# EAGLE design OpenSprinkler_v142 (EAGLE 6.4)
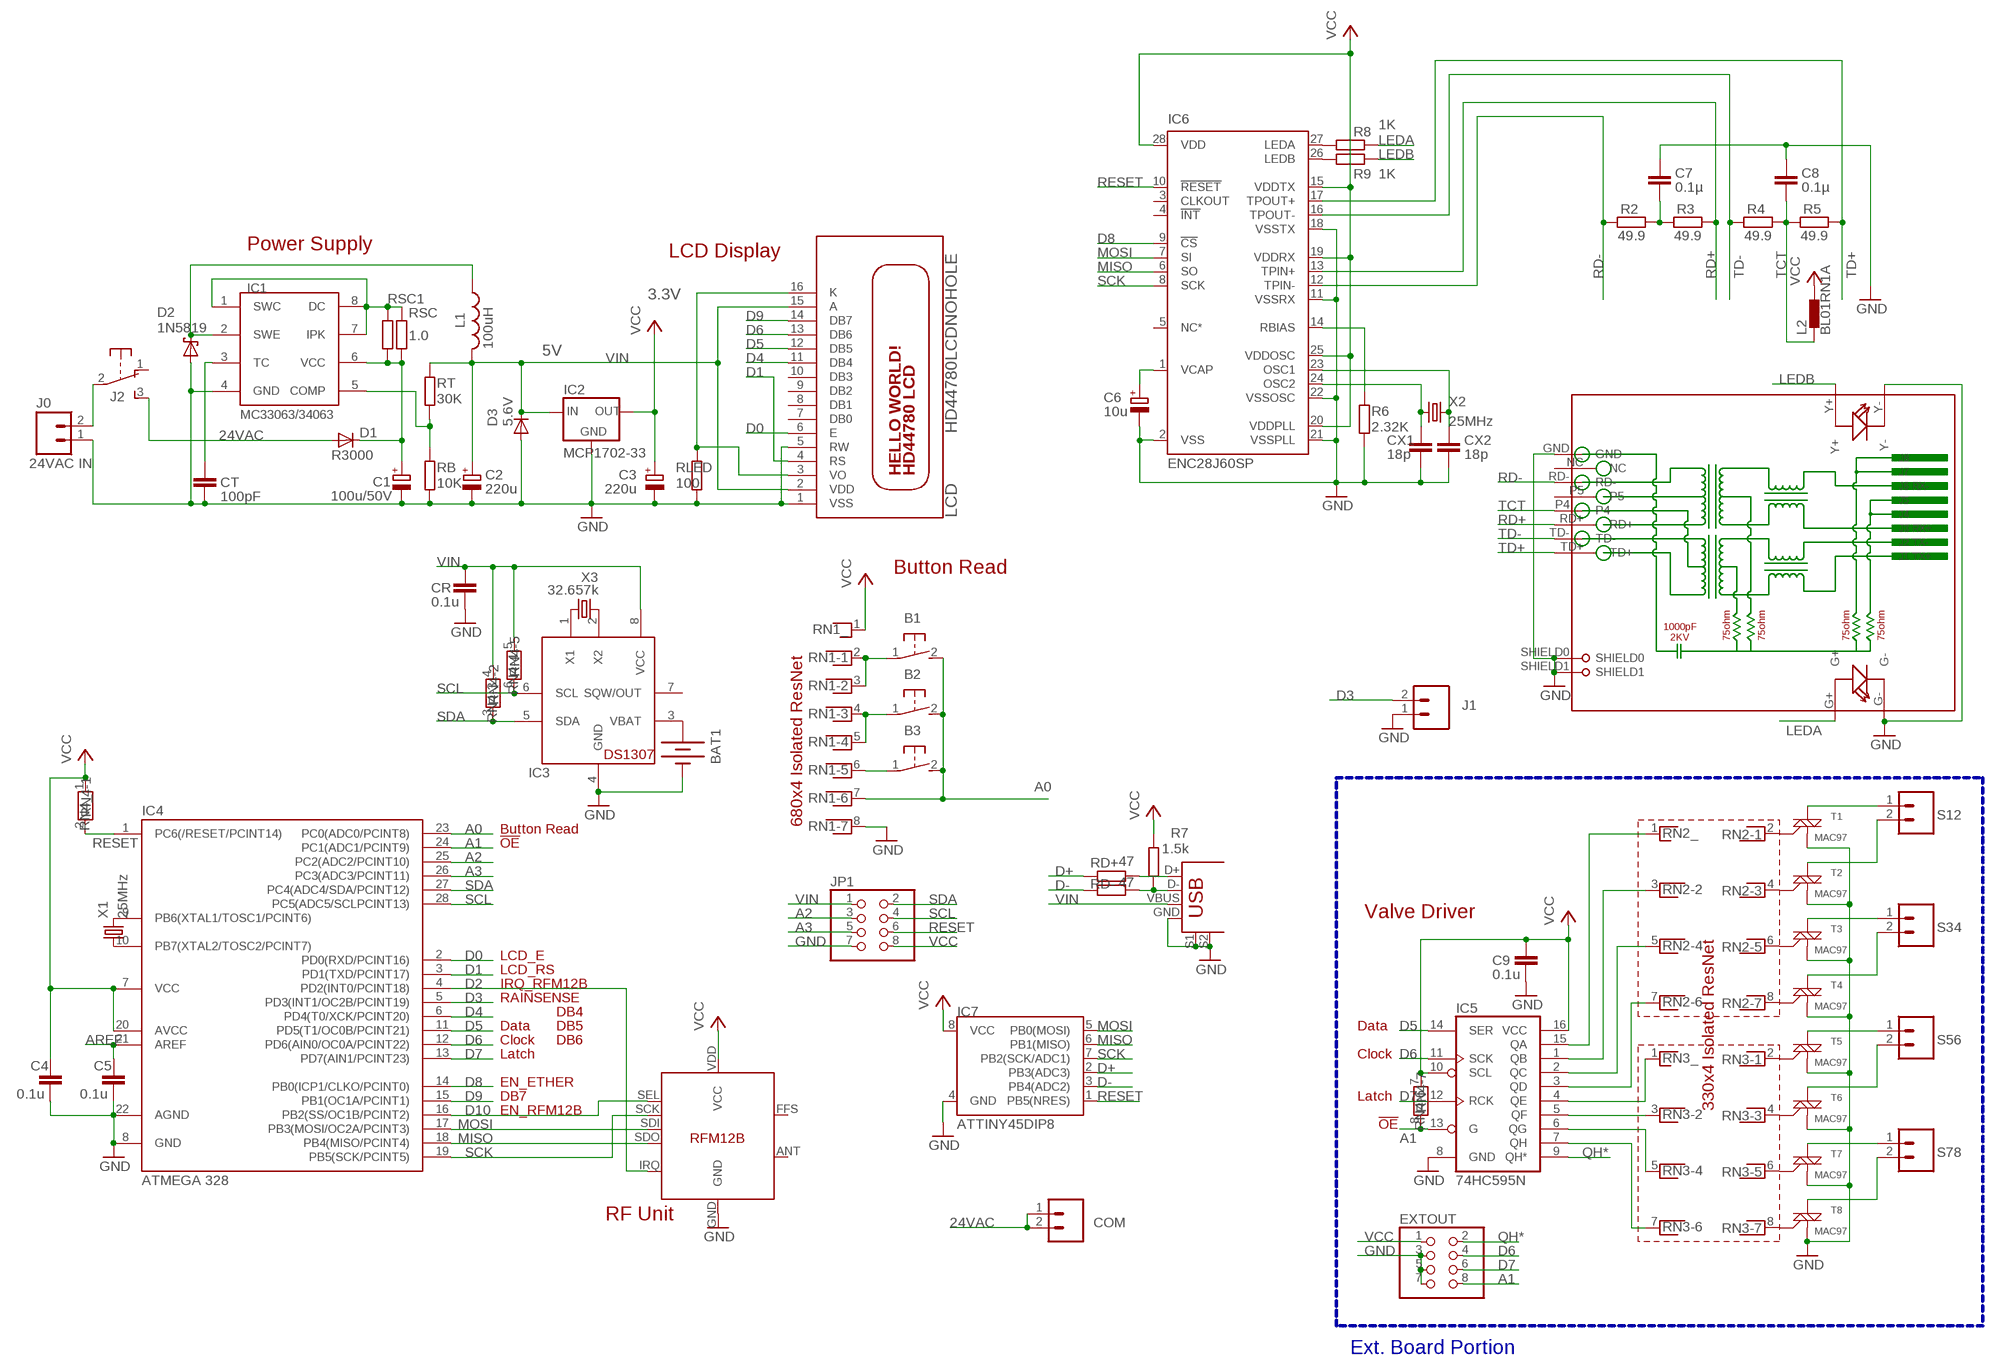
[diagram p0: schematic, sheet 1]

## Parts
B1  31-XX  [B3F-31XX]
B2  31-XX  [B3F-31XX]
B3  31-XX  [B3F-31XX]
BAT1  BATTERY12PTH  [BATTCON_12MM_PTH]
C1  100u/50V  CPOL-EUE3.5-8  [E3,5-8]
C2  220u  CPOL-EUE2-5  [E2-5]
C3  220u  CPOL-EUE2-5  [E2-5]
C4  0.1u  C-EU025-024X044  [C025-024X044]
C5  0.1u  C-EU025-024X044  [C025-024X044]
C6  10u  CPOL-EUE1.8-4  [E1,8-4]
C7  0.1µ  C-EU025-024X044  [C025-024X044]
C8  0.1µ  C-EU025-024X044  [C025-024X044]
C9  0.1u  C-EU025-024X044  [C025-024X044]
COM  M025MM  [SCREWTERMINAL-5MM-2]
CR  0.1u  C-EU025-024X044  [C025-024X044]
CT  100pF  C-EU025-024X044  [C025-024X044]
CX1  18p  C-EU025-024X044  [C025-024X044]
CX2  18p  C-EU025-024X044  [C025-024X044]
D1  R3000  DIODE-DO41-7.6  [DO41-7.6]
D2  1N5819  1N5817-B  [DO41-7.6]
D3  5.6V  1N4148DO35-7  [DO35-7]
EXTOUT  PINHD-2X4  [2X04]
IC1  MC33063/MC34063P  [DIL08]
IC2  MCP1702-33  MCP1700INLINE  [TO92-INLINE]
IC3  DS1307  [DIL08]
IC4  ATMEGA 328  ATMEGA48/88/168-PU  [DIL28-3]
IC5  74HC595N  74LS595N  [DIL16]
IC6  ENC28J60SP  [DIL28-3]
IC7  ATTINY45DIP8  [DIP08]
IC8  RFM12B  [RFM12B]
J0  24VAC IN  M025MM  [SCREWTERMINAL-5MM-2]
J1  M025MM  [SCREWTERMINAL-5MM-2]
J2  EG1206  [EG1206]
JP1  PINHD-2X4  [2X04]
L1  100uH  L-US6000-XXX-RC  [6000-XXXX-RC]
L2  BL01RN1A  [BL01RN1A]
LCD  HD44780LCDNOHOLE  [LCD1602A]
R2  49.9  R-EU_0204/7  [0204/7]
R3  49.9  R-EU_0204/7  [0204/7]
R4  49.9  R-EU_0204/7  [0204/7]
R5  49.9  R-EU_0204/7  [0204/7]
R6  2.32K  R-EU_0204/7  [0204/7]
R7  1.5k  R-EU_0204/7  [0204/7]
R8  1K  R-EU_0204/7  [0204/7]
R9  1K  R-EU_0204/7  [0204/7]
RB  10K  R-EU_0204/7  [0204/7]
RD+  47  R-EU_0204/7  [0204/7]
RD-  47  R-EU_0204/7  [0204/7]
RJ1  HR911105A  [HR911105A]
RLED  100  R-EU_0204/7  [0204/7]
RN1  RNX7  [RN-8]
RN2  RNX7  [RN-8]
RN3  RNX7  [RN-8]
RN4  RNX7  [RN-8]
RSC  1.0  R-EU_0204/7  [0204/7]
RSC1  1.0  R-EU_0204/7  [0204/7]
RT  30K  R-EU_0204/7  [0204/7]
S12  M025MM  [SCREWTERMINAL-5MM-2]
S34  M025MM  [SCREWTERMINAL-5MM-2]
S56  M025MM  [SCREWTERMINAL-5MM-2]
S78  M025MM  [SCREWTERMINAL-5MM-2]
T1  MAC97  LX807DE  [TO-92]
T2  MAC97  LX807DE  [TO-92]
T3  MAC97  LX807DE  [TO-92]
T4  MAC97  LX807DE  [TO-92]
T5  MAC97  LX807DE  [TO-92]
T6  MAC97  LX807DE  [TO-92]
T7  MAC97  LX807DE  [TO-92]
T8  MAC97  LX807DE  [TO-92]
USB  USB+SHIELD  [USB-B-PTH]
X1  25MHz  CRYSTALHC49US  [HC49US]
X2  25MHz  CRYSTALHC49US  [HC49US]
X3  32.657k  CRYSTALTC26H  [TC26H]

## Nets
24VAC [power]: COM.1 COM.2 D1.A J2.3(S)
A0: B1.2(S) B2.2(S) B3.2(S) IC4.23(PC0(ADC0/PCINT8)) RN1.7
A1: EXTOUT.8 IC4.24(PC1(ADC1/PCINT9)) IC5.13(G) RN4.8
A2: IC4.25(PC2(ADC2/PCINT10)) JP1.3
A3: IC4.26(PC3(ADC3/PCINT11)) JP1.5
AREF: C5.1 IC4.21(AREF)
D0: IC4.2(PD0(RXD/PCINT16)) LCD.6(E)
D1: IC4.3(PD1(TXD/PCINT17)) LCD.4(RS)
D2: IC4.4(PD2(INT0/PCINT18)) IC8.IRQ
D3: IC4.5(PD3(INT1/OC2B/PCINT19)) J1.2
D4: IC4.6(PD4(T0/XCK/PCINT20)) LCD.11(DB4)
D5: IC4.11(PD5(T1/OC0B/PCINT21)) IC5.14(SER) LCD.12(DB5)
D6: EXTOUT.4 IC4.12(PD6(AIN0/OC0A/PCINT22)) IC5.11(SCK) LCD.13(DB6)
D7: EXTOUT.6 IC4.13(PD7(AIN1/PCINT23)) IC5.12(RCK)
D8: IC4.14(PB0(ICP1/CLKO/PCINT0)) IC6.9(!CS)
D9: IC4.15(PB1(OC1A/PCINT1)) LCD.14(DB7)
D10: IC4.16(PB2(SS/OC1B/PCINT2)) IC8.SEL
D+: IC7.2(PB3(ADC3)) RD+.1
D-: IC7.3(PB4(ADC2)) RD-.1
GND [power]: BAT1.GND(-) C1.- C2.- C3.- C4.2 C5.2 C6.- C7.1 C8.1 C9.2 CR.2 CT.2 CX1.2 CX2.2 D2.A D3.A EXTOUT.3 EXTOUT.5 EXTOUT.7 IC1.4(GND) IC2.1(GND) IC3.4(GND) IC4.8(GND) IC4.22(AGND) IC5.8(GND) IC6.2(VSS) IC6.11(VSSRX) IC6.18(VSSTX) IC6.21(VSSPLL) IC6.22(VSSOSC) IC7.4(GND) IC8.GND J0.1 J1.1 JP1.7 LCD.1(VSS) LCD.5(RW) R6.2 RB.2 RJ1.G- RJ1.GND RJ1.SHIELD0 RJ1.SHIELD1 RJ1.Y- RLED.2 RN1.8 T1.1(M1) T2.1(M1) T3.1(M1) T4.1(M1) T5.1(M1) T6.1(M1) T7.1(M1) T8.1(M1) USB.GND USB.S1 USB.S2
LEDA: R8.2 RJ1.G+
LEDB: R9.2 RJ1.Y+
MISO: IC4.18(PB4(MISO/PCINT4)) IC6.6(SO) IC7.6(PB1(MISO)) IC8.SDO
MOSI: IC4.17(PB3(MOSI/OC2A/PCINT3)) IC6.7(SI) IC7.5(PB0(MOSI)) IC8.SDI
N$2: IC4.9(PB6(XTAL1/TOSC1/PCINT6)) X1.2
N$3: RN2.2 T1.2(G)
N$4: IC5.5(QF) RN3.3
N$5: IC5.6(QG) RN3.5
N$6 [power]: J0.2 J2.2(P)
N$7: IC5.7(QH) RN3.7
N$8: IC4.10(PB7(XTAL2/TOSC2/PCINT7)) X1.1
N$9 [power]: C1.+ D1.C IC1.6(VCC) RSC1.2 RSC.2
N$10: IC5.4(QE) RN3.1
N$11: IC5.3(QD) RN2.7
N$12: IC5.2(QC) RN2.5
N$13: IC5.1(QB) RN2.3
N$14: IC5.15(QA) RN2.1
N$15: RN2.4 T2.2(G)
N$16 [power]: S12.1 T1.3(M2)
N$17 [power]: S12.2 T2.3(M2)
N$18 [power]: S34.1 T3.3(M2)
N$19: RN2.6 T3.2(G)
N$20 [power]: S34.2 T4.3(M2)
N$21: RN2.8 T4.2(G)
N$22 [power]: S56.1 T5.3(M2)
N$23 [power]: S56.2 T6.3(M2)
N$24 [power]: S78.1 T7.3(M2)
N$25 [power]: S78.2 T8.3(M2)
N$26: RN3.2 T5.2(G)
N$27: RN3.4 T6.2(G)
N$28: RN3.6 T7.2(G)
N$29: RN3.8 T8.2(G)
N$32: B1.1(P) RN1.2 RN1.3
N$33: B3.1(P) RN1.6
N$35: B2.1(P) RN1.4 RN1.5
N$36: BAT1.VCC@1(+) IC3.3(VBAT)
N$37: IC6.27(LEDA) R8.1
N$38: RD+.2 USB.D+
N$39: IC6.26(LEDB) R9.1
N$40 [power]: IC1.1(SWC) IC1.7(IPK) IC1.8(DC) RSC1.1 RSC.1
N$45: R7.1 RD-.2 USB.D-
N$46 [power]: D2.C IC1.2(SWE) L1.1
N$47: IC3.2(X2) X3.2
N$48: LCD.3(VO) LCD.16(K) RLED.1
N$49: CT.1 IC1.3(TC)
N$50: C6.+ IC6.1(VCAP)
N$51: IC6.14(RBIAS) R6.1
N$52: CX1.1 IC6.24(OSC2) X2.1
N$53: CX2.1 IC6.23(OSC1) X2.2
N$54: C7.2 R2.2 R3.1
N$55: IC1.5(COMP) RB.1 RT.2
N$57: IC3.1(X1) X3.1
QH*: EXTOUT.2 IC5.9(QH*)
RD+: IC6.13(TPIN+) R3.2 RJ1.RD+
RD-: IC6.12(TPIN-) R2.1 RJ1.RD-
RESET: IC4.1(PC6(/RESET/PCINT14)) IC6.10(!RESET) IC7.1(PB5(NRES)) JP1.6 RN4.2
SCK: IC4.19(PB5(SCK/PCINT5)) IC6.8(SCK) IC7.7(PB2(SCK/ADC1)) IC8.SCK
SCL: IC3.6(SCL) IC4.28(PC5(ADC5/SCLPCINT13)) JP1.4 RN4.6
SDA: IC3.5(SDA) IC4.27(PC4(ADC4/SDA/PCINT12)) JP1.2 RN4.3
TCT: C8.2 L2.1 R4.2 R5.1 RJ1.P4
TD+: IC6.17(TPOUT+) R5.2 RJ1.TD+
TD-: IC6.16(TPOUT-) R4.1 RJ1.TD-
VCC: C3.+ C4.1 C9.1 EXTOUT.1 IC2.3(OUT) IC4.7(VCC) IC4.20(AVCC) IC5.10(SCL) IC5.16(VCC) IC6.15(VDDTX) IC6.19(VDDRX) IC6.20(VDDPLL) IC6.25(VDDOSC) IC6.28(VDD) IC7.8(VCC) IC8.VDD(VCC) JP1.8 L2.2 R7.2 RN1.1 RN4.1 RN4.7
VIN [power]: C2.+ CR.1 D3.C IC2.2(IN) IC3.8(VCC) JP1.1 L1.2 LCD.2(VDD) LCD.15(A) RN4.4 RN4.5 RT.1 USB.VBUS
Unconnected: IC3.7(SQW/OUT) IC6.3(CLKOUT) IC6.4(!INT) IC6.5(NC*) IC8.ANT IC8.FFS J2.1(O) LCD.7(DB0) LCD.8(DB1) LCD.9(DB2) LCD.10(DB3) RJ1.NC RJ1.P5

## Buses
B$1

## Notes on the sheet
- Power Supply
- LCD Display
- 3.3V
- 5V
- Button Read
- 680x4 Isolated ResNet
- Button Read
- !OE
- Valve Driver
- 330x4 Isolated ResNet
- LCD_E
- LCD_RS
- IRQ_RFM12B
- RAINSENSE
- DB4
- Data | DB5 | Data
- Clock | DB6
- Latch | Clock
- EN_ETHER
- DB7 | Latch
- EN_RFM12B
- !OE
- RF Unit
- Ext. Board Portion

## Library data of the parts
B1-B3 = adafruit:31-XX: OMRON SWITCH Now with beefier pads!
BAT1 = SparkFun:BATTERY: Battery Holders Various common sizes : AA, AAA, 20mm coin cell and 12mm coin cell.
C1-C3 C6 = resistor:CPOL-EU: POLARIZED CAPACITOR, European symbol
C4 C5 C9 CR CT = rcl:C-EU: CAPACITOR, European symbol
C7 C8 CX1 CX2 = resistor:C-EU: CAPACITOR, European symbol
COM J0 J1 S12 S34 S56 S78 = SparkFun:M02: Header 2 Standard 2-pin 0.1" header. Use with straight break away headers (SKU : PRT-00116), right angle break away headers (PRT-00553), swiss pins (PRT-00743), machine pins (PRT-00117), and female headers (PRT-00115). Molex polarized connector foot print use with SKU : PRT-08233 with associated crimp pins and housings.
D1 = diode:DIODE-: DIODE
D2 = diode:1N581*: 1.0A SCHOTTKY BARRIER RECTIFIER Source: http://www.diodes.com/datasheets/ds23001.pdf
D3 = diode:1N4148: DIODE high speed (Philips)
EXTOUT JP1 = pinhead:PINHD-2X4: PIN HEADER
IC1 = adafruit:MC33063/MC34063: MC33063 and MC34063 Basic DC/DC converter with internal power-NPN transistor, 100KHz, 1.5A peak switch current. 3-40 input/output.
IC2 = adafruit:MCP1700: VOLTAGE REGULATOR
IC3 = adafruit:DS1307: DS1307 Real time clock (RTC) with battery backup ability. Talk to it via i2c
IC4 = atmega8:ATMEGA48/88/168-PU
IC5 = SparkFun:74*595: 8-bit SHIFT REGISTER, output latch
IC6 = microchip:ENC28J60: Stand-Alone Ethernet Controller with SPI Interface Source: http://ww1.microchip.com/downloads/en/DeviceDoc/39662c.pdf; MF: MICROCHIP; MPN: ENC28J60/SP; OC_FARNELL: 1084619; OC_NEWARK: 96K3661
IC7 = SparkFun:ATTINY45: Atmel ATTiny45
IC8 = JeeLabs:RFM12B
J2 = adafruit:EG1206
L1 = rcl:L-US: INDUCTOR, American symbol
L2 = inductors:BL0: Noise Suppression Products/EMI Suppression Filters, Lead EMIFIL(R) Inductor Type Source: http://www.murata.com .. BL01RN1_DS.pdf
LCD = adafruit:HD44780LCD: HD44780 LCD Standard character type LCDs, available in sizes from 8x1 to 40x4!
R2-R9 RB RD+ RD- RLED RSC RSC1 RT = rcl:R-EU_: RESISTOR, European symbol
RJ1 = CONNECTER:HR911105A
RN1-RN4 = resistor-net:RNX7: RESISTOR NETWORK; OC_FARNELL: unknown; OC_NEWARK: unknown
T1-T8 = SparkFun:LX807DE: LX807DE Triac http://www.littelfuse.com/data/en/Data_Sheets/Littelfuse_Triac_LX8.pdf
USB = SparkFunNew:USB+SHIELD: USB+Shield USB connector with shield pins connectable
X1 X2 = SparkFun:CRYSTAL: Crystals Various standard crystals. Proven footprints. Spark Fun Electronics SKU : COM-00534
X3 = crystal:CRYSTAL: CRYSTAL; OC_FARNELL: unknown; OC_NEWARK: unknown

## Net classes
0 default: width 0.305 mm, clearance 0.203 mm
1 power: width 0.813 mm, clearance 0.203 mm

## Board
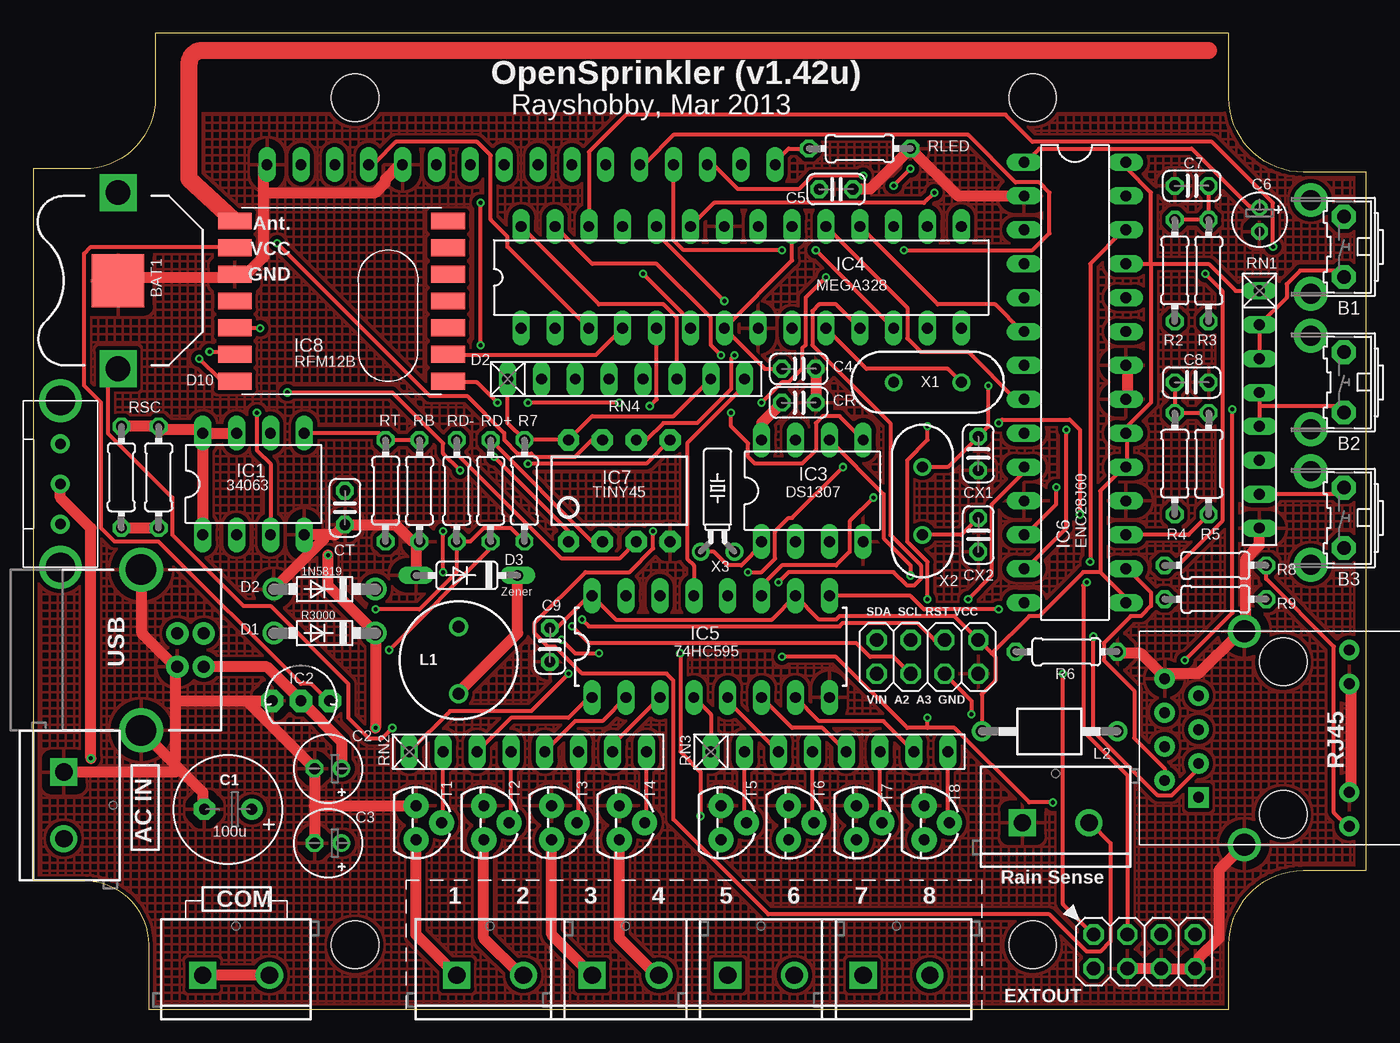
[diagram p1: board, top side]
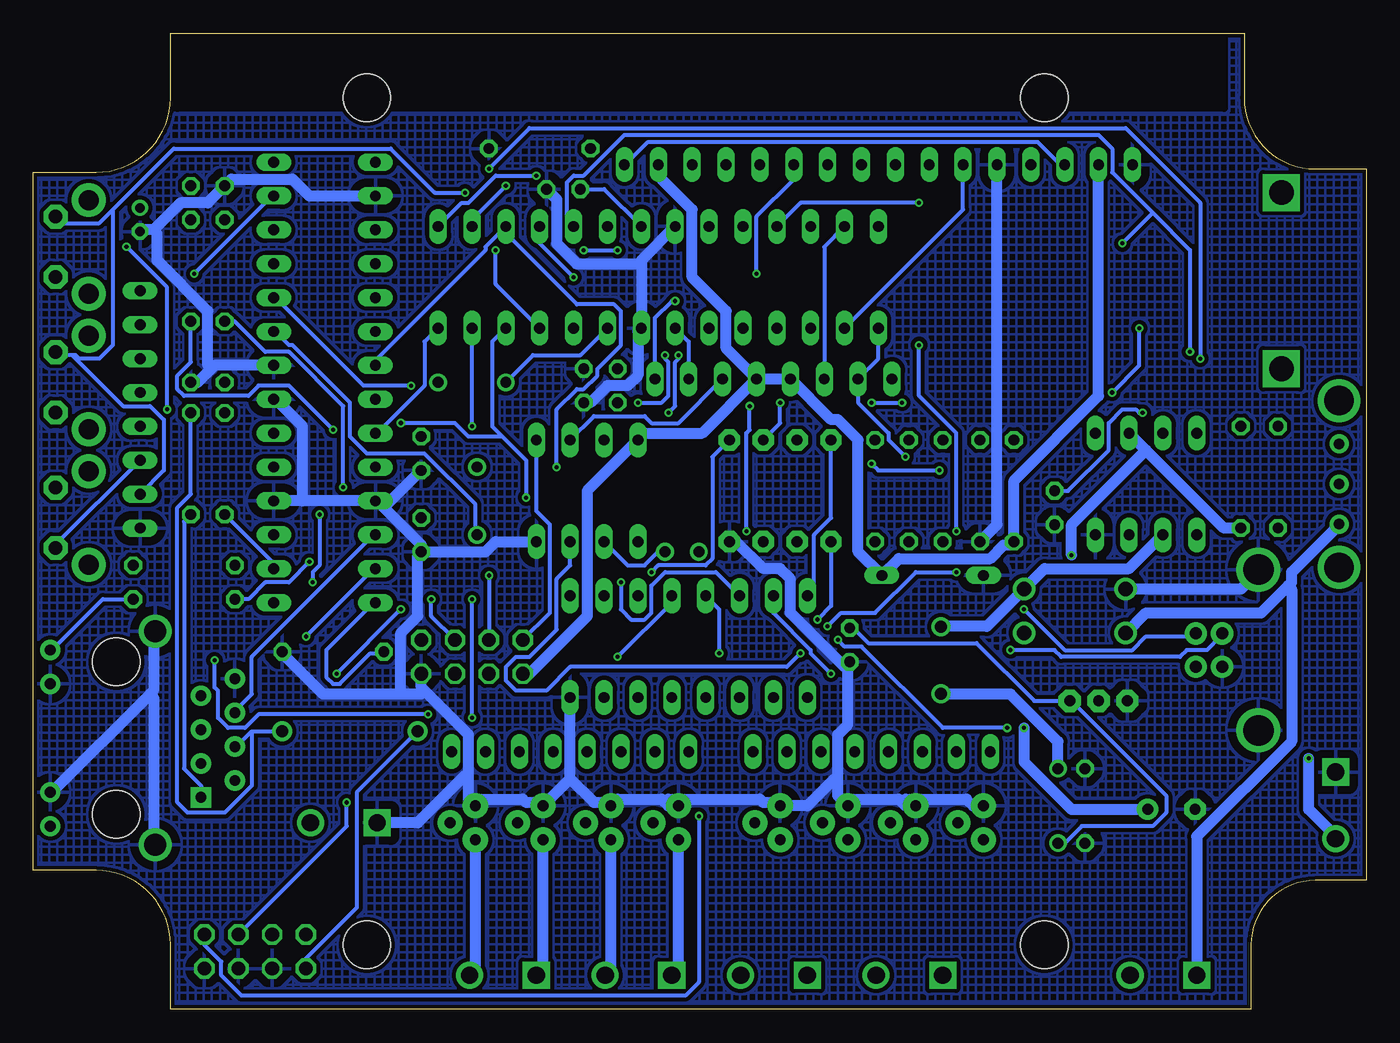
[diagram p2: board, bottom side, seen from below]

Size 99.95 x 73.15 mm. Coordinates in mm from the lower left corner, seen from the top.
Outline: 8.64,0 89.66,0 89.66,4.83 arc-90 95.25,10.41 99.95,10.41 99.95,62.74 95.25,62.74 arc-90 89.66,68.33 89.66,73.15 9.14,73.15 9.14,68.33 arc-90 3.81,62.99 0,62.99 0,9.65 3.81,9.65 arc-90 8.64,4.83 8.64,0
Copper layers (1*16): Top 0.035mm / dielectric 1.5mm / Bottom 0.035mm
Design rules "Fusion_eagle_rule_v1.1 *": minimum track width 6mil, minimum drill 12mil, track to track 6mil, track to pad 6mil, pad to pad 8mil, via to via 8mil, smd to smd 0mil, copper to edge 10mil, drill to drill 10mil, minimum pad ring 10mil, minimum via ring 6mil, stop-mask expansion 2mil, vias tented up to drill 100mil, thermal gap 25mil
Holes 3.56 mm at 24.13,4.83 74.93,4.83 24.13,68.33 74.93,68.33
tRestrict: area 10.7,67.6 to 89.2,72.6
bRestrict: area 10.7,67.6 to 89.2,72.6
vRestrict: area 21.6,2.3 to 26.7,7.4; area 72.4,2.3 to 77.5,7.4; area 64.8,33 to 68.6,43.2; area 25.9,43.7 to 29.7,44.5; area 31,43.7 to 37.6,44.5; area 17.3,13.5 to 18,14.2; area 93,59.7 to 93.7,60.2; area 62.5,29.5 to 71.6,30.2; area 62.5,22.9 to 71.6,23.6; area 42.2,38.4 to 45.5,40.4; area 56.4,38.4 to 60.2,40.6

### Footprints (pad centres in the part's own frame; a part is rotated, then mirrored left to right if it is on the bottom)
B3F-31XX = drill 1.016 pad 1.778 octagon: 1 -2.261,-1.245; 2 2.261,-1.245 | drill 1.499 pad 2.54: 3 -3.505,1.245; 4 3.505,1.245
BATTCON_12MM_PTH = smd 3.962 x 3.962: GND 0,0 | drill 1.854 square: VCC@1 -6.604,0; VCC@2 6.604,0
E3,5-8 = drill 0.813 pad 1.6: + -1.778,0 | drill 0.813 pad 1.6 octagon: - 1.778,0
E2-5 = drill 0.813 pad 1.27: + -1.016,0 | drill 0.813 pad 1.27 octagon: - 1.016,0
C025-024X044 = drill 0.813 octagon: 1 -1.27,0; 2 1.27,0
E1,8-4 = drill 0.711 pad 1.168: + -0.889,0 | drill 0.711 pad 1.168 octagon: - 0.889,0
SCREWTERMINAL-5MM-2 = drill 1.3 pad 2.032 square: 1 0,0 | drill 1.3 pad 2.032: 2 5,0
DO41-7.6 = drill 1.1 pad 1.7: A 3.81,0; C -3.81,0
DO35-7 = drill 0.813 long: A 3.81,0; C -3.81,0
2X04 = drill 1.016 octagon: 1 -3.81,-1.27; 2 -3.81,1.27; 3 -1.27,-1.27; 4 -1.27,1.27; 5 1.27,-1.27; 6 1.27,1.27; 7 3.81,-1.27; 8 3.81,1.27
DIL08 = drill 0.813 long: 1 -3.81,-3.81; 2 -1.27,-3.81; 3 1.27,-3.81; 4 3.81,-3.81; 5 3.81,3.81; 6 1.27,3.81; 7 -1.27,3.81; 8 -3.81,3.81
TO92-INLINE = drill 0.813 pad 1.676 octagon: 1 -2.159,0; 2 0,0; 3 2.159,0
DIL28-3 = drill 0.813 long: 1 -16.51,-3.81; 2 -13.97,-3.81; 3 -11.43,-3.81; 4 -8.89,-3.81; 5 -6.35,-3.81; 6 -3.81,-3.81; 7 -1.27,-3.81; 8 1.27,-3.81; 9 3.81,-3.81; 10 6.35,-3.81; 11 8.89,-3.81; 12 11.43,-3.81; 13 13.97,-3.81; 14 16.51,-3.81; 15 16.51,3.81; 16 13.97,3.81; 17 11.43,3.81; 18 8.89,3.81; 19 6.35,3.81; 20 3.81,3.81; 21 1.27,3.81; 22 -1.27,3.81; 23 -3.81,3.81; 24 -6.35,3.81; 25 -8.89,3.81; 26 -11.43,3.81; 27 -13.97,3.81; 28 -16.51,3.81
DIL16 = drill 0.813 long: 1 -8.89,-3.81; 2 -6.35,-3.81; 3 -3.81,-3.81; 4 -1.27,-3.81; 5 1.27,-3.81; 6 3.81,-3.81; 7 6.35,-3.81; 8 8.89,-3.81; 9 8.89,3.81; 10 6.35,3.81; 11 3.81,3.81; 12 1.27,3.81; 13 -1.27,3.81; 14 -3.81,3.81; 15 -6.35,3.81; 16 -8.89,3.81
DIP08 = drill 0.813 pad 1.6 octagon: 1 -3.81,-3.81; 2 -1.27,-3.81; 3 1.27,-3.81; 4 3.81,-3.81; 5 3.81,3.81; 6 1.27,3.81; 7 -1.27,3.81; 8 -3.81,3.81
RFM12B = smd 2.54 x 1.27: ANT 8,-6; FFS -8,2; GND 8,-2; IRQ -8,4; P$8 -8,0; P$9 -8,-2; P$10 -8,-4; P$12 -8,-6; P$16 8,0; SCK 8,4; SDI 8,2; SDO -8,6; SEL 8,6; VDD 8,-4
EG1206 = drill 0.8 pad 1.422: 1 -3,0; 2 0,0; 3 3,0 | drill 2.2: MT1 -6.25,0; MT2 6.25,0
6000-XXXX-RC = drill 0.9 pad 1.422: 1 -2.5,0; 2 2.5,0
BL01RN1A = drill 0.9 pad 1.5: 1 -5.08,0; 2 5.08,0
LCD1602A = drill 0.8 long: 1 8,33.46; 2 10.54,33.46; 3 13.08,33.46; 4 15.62,33.46; 5 18.16,33.46; 6 20.7,33.46; 7 23.24,33.46; 8 25.78,33.46; 9 28.32,33.46; 10 30.86,33.46; 11 33.4,33.46; 12 35.94,33.46; 13 38.48,33.46; 14 41.02,33.46; 15 43.56,33.46; 16 46.1,33.46
0204/7 = drill 0.813 octagon: 1 -3.81,0; 2 3.81,0
HR911105A = drill 0.813 pad 1.524: G+ 4.953,-6.604; G- 4.953,-4.064; GND -8.89,4.445; NC -6.35,3.175; P4 -8.89,-0.635; P5 -6.35,0.635; RD+ -6.35,-1.905; RD- -8.89,1.905; TD- -8.89,-3.175; Y+ 4.953,6.604; Y- 4.953,4.064 | drill 1.651 pad 2.159: SHIELD0 -2.921,8.001; SHIELD1 -2.921,-8.001 | drill 0.813 pad 1.524 square: TD+ -6.35,-4.445 | hole 3.556: 0,-5.715; 0,5.715
RN-8 = drill 0.813 long: 1 -8.89,0; 2 -6.35,0; 3 -3.81,0; 4 -1.27,0; 5 1.27,0; 6 3.81,0; 7 6.35,0; 8 8.89,0
TO-92 = drill 0.813 pad 1.88: 1 -1.27,0; 2 0,1.905; 3 1.27,0
USB-B-PTH = drill 0.914 pad 1.676: D+ 0,1.25; D- 1.981,1.25; GND 0,-1.25; VBUS 1.981,-1.25 | drill 2.286: S1 -2.718,-6.02; S2 -2.718,6.02
HC49US = drill 0.813: 1 -2.54,0; 2 2.54,0
TC26H = drill 0.813: 1 -1.27,0; 2 1.27,0

### Placement (x,y rotation side)
B1  97.03,57.15 90 top
B2  97.03,46.99 90 top
B3  97.03,36.83 90 top
BAT1  6.35,54.61 90 top
C1  14.61,14.99 180 top
C2  22.1,18.03 180 top
C3  22.1,12.45 180 top
C4  57.4,48.01 0 top
C5  60.2,61.47 0 top
C6  91.95,59.18 270 top
C7  86.87,61.72 0 top
C8  86.87,46.99 180 top
C9  38.73,27.3 270 top
COM  12.7,2.54 0 top
CR  57.4,45.47 0 top
CT  23.37,37.59 270 top
CX1  70.87,41.66 270 top
CX2  70.87,35.56 270 top
D1  21.84,28.19 180 top
D2  21.84,31.5 180 top
D3  32.51,32.51 180 top
EXTOUT  83.31,4.32 0 top
IC1  16.51,39.37 0 top
IC2  20.07,23.11 0 top
IC3  58.42,38.86 0 top
IC4  53.09,54.86 0 top
IC5  50.8,27.18 0 top
IC6  78.11,46.99 270 top
IC7  43.94,38.86 0 top
IC8  23.11,53.09 180 top
J0  2.29,17.78 270 top
J1  74.17,13.97 0 top
J2  2.03,39.37 270 top
JP1  67.06,26.42 0 top
L1  31.88,26.16 270 top
L2  76.2,20.83 180 top
LCD  9.53,29.84 0 top
R2  85.6,55.37 90 top
R3  88.14,55.37 270 top
R4  85.6,40.89 90 top
R5  88.14,40.89 270 top
R6  77.47,26.8 0 top
R7  36.83,38.86 90 top
R8  88.65,33.27 0 top
R9  88.65,30.73 0 top
RB  28.96,38.86 270 top
RD+  34.29,38.86 270 top
RD-  31.75,38.86 270 top
RJ1  93.73,20.32 0 top
RLED  61.98,64.52 0 top
RN1  91.95,44.96 270 top
RN2  37.08,19.3 0 top
RN3  59.69,19.3 0 top
RN4  44.45,47.24 0 top
RSC  6.6,39.88 270 top
RSC1  9.4,39.88 270 top
RT  26.42,38.86 90 top
S12  31.75,2.54 0 top
S34  41.91,2.54 0 top
S56  52.07,2.54 0 top
S78  62.23,2.54 0 top
T1  28.7,13.97 270 top
T2  33.78,13.97 270 top
T3  38.86,13.97 270 top
T4  43.94,13.97 270 top
T5  51.56,13.97 270 top
T6  56.64,13.97 270 top
T7  61.72,13.97 270 top
T8  66.8,13.97 270 top
USB  10.79,26.92 0 top
X1  67.06,46.99 180 top
X2  66.67,38.1 270 top
X3  51.31,34.29 0 top

### Tracks (layer width: path | path; a pad name or v marks a point on that pad's centre or on a via)
24VAC
  Top 0.813: COM.2 COM.1
  Bottom 0.813: 5.84,31.75 7.87,29.72 16.51,29.72 D1.A | 5.84,31.75 5.59,32 5.59,32.77 2.03,36.32 J2.3 | COM.1 12.7,12.95 5.59,20.07 5.59,31.5 5.84,31.75
A0  (via drill 0.3)
  Top 0.305: RN1.7 97.79,38.61 B3.2 | IC4.23 51.05,60.45 66.8,60.45 v67.56,61.21
  Bottom 0.305: v67.56,61.21 69.85,61.21 73.15,64.52 89.41,64.52 93.98,59.94 | 93.98,59.94 95,58.93 97.79,58.93 B1.2 | 97.03,49.02 96.77,49.02 96.52,48.77 95,48.77 93.98,49.78 93.98,59.94 | 97.03,49.02 98.04,49.02 B2.2 | RN1.7 90.17,40.39 90.17,44.2 91.19,45.21 93.22,45.21 97.03,49.02
A1  (via drill 0.3)
  Top 0.305: IC5.13 49.53,33.27 49.02,33.78 49.02,42.42 53.34,46.74 RN4.8 | IC4.24 46.74,58.17 v51.82,53.09 | v50.04,14.48 50.04,17.78 48.51,19.3 v48.51,26.67
  Bottom 0.305: v51.82,53.09 52.07,53.09 53.34,51.82 RN4.8 | EXTOUT.8 87.12,4.83 85.85,3.56 85.85,2.54 84.33,1.02 51.05,1.02 50.04,2.03 v50.04,14.48 | v48.51,26.67 48.51,29.97 IC5.13
A2  (via drill 0.3)
  Top 0.305: v33.53,49.78 v33.53,60.45 | v30.73,32.77 v30.73,35.81 | v40.39,28.7 41.66,27.43 61.72,27.43 62.74,26.42 64.52,26.42 JP1.3
  Bottom 0.305: IC4.25 42.42,60.45 v33.53,60.45 | v33.53,49.78 33.53,45.97 30.73,43.18 v30.73,35.81 | v30.73,32.77 33.78,32.77 36.83,29.72 39.37,29.72 v40.39,28.7
A3  (via drill 0.3)
  Top 0.305: IC4.26 41.66,64.26 44.45,67.06 72.9,67.06 74.93,65.02 88.39,65.02 92.96,60.45 v92.96,57.15 | v89.92,44.96 89.92,29.72 v86.36,26.16 | v70.36,22.1 70.36,23.11 JP1.5
  Bottom 0.305: v92.96,57.15 89.92,54.1 v89.92,44.96 | v86.36,26.16 86.36,24.13 86.11,23.88 86.11,21.84 85.34,21.08 84.07,21.08 83.06,22.1 v70.36,22.1
AREF
  Bottom 0.305: IC4.21 57.15,61.47 C5.1
D0
  Bottom 0.305: IC4.2 30.23,59.94 30.23,63.25 LCD.6
D1
  Top 0.305: IC4.3 35.56,57.15 35.56,57.91 34.29,59.18 34.29,64.01 33.27,65.02 27.18,65.02 25.65,63.5 25.15,63.5 LCD.4
D2
  Top 0.305: IC4.4 42.16,49.02 31.24,49.02 IC8.IRQ
D3  (via drill 0.3)
  Top 0.305: IC4.5 46.74,45.72 v46.23,45.21 | v46.48,35.81 46.48,34.54 44.7,32.77 41.4,32.77 37.59,28.96 37.59,28.19 38.61,27.18 39.12,27.18 41.15,25.15 47.5,25.15 48.01,24.64 48.01,14.22 55.12,7.11 76.2,7.11 78.99,4.32 80.01,4.32 80.77,5.08 80.77,12.45 79.25,13.97 J1.2
  Bottom 0.305: v46.23,45.21 46.23,43.43 46.48,43.18 v46.48,35.81
D4  (via drill 0.3)
  Top 0.305: v45.72,55.12 49.28,51.56 IC4.6
  Bottom 0.305: v45.72,55.12 45.72,59.44 42.93,62.23 42.93,63.25 LCD.11
D5  (via drill 0.3)
  Top 0.305: v65.28,56.9 74.93,56.9 76.2,58.17 76.2,61.21 75.44,61.98 73.66,61.98 70.1,65.53 48.01,65.53 45.97,63.5 45.47,63.5 LCD.12 | v55.88,32 56.64,32.77 64.52,32.77 65.53,31.75 66.04,31.75 66.55,32.26 66.55,33.27 64.26,35.56 64.26,43.94 58.42,49.78 58.42,52.32 58.93,52.83 60.2,52.83 IC4.11
  Bottom 0.305: v65.28,56.9 65.28,54.36 IC4.11 | IC5.14 48.77,32.77 52.58,32.77 53.59,31.75 53.59,29.72 54.1,29.21 55.12,29.21 55.88,29.97 v55.88,32
D6  (via drill 0.3)
  Top 0.305: v56.13,56.9 48.77,56.9 48.01,57.66 48.01,63.25 LCD.13 | IC4.12 v58.67,56.9 | IC5.11 54.61,31.75 56.13,33.27 60.2,33.27 61.21,34.29 61.21,36.58 v62.99,38.35 | EXTOUT.4 82.04,17.53 78.74,20.83 78.74,31.75 v78.99,32 | v78.49,37.08 78.49,43.43 77.72,44.2 72.64,44.2 v72.39,43.94
  Bottom 0.305: v58.67,56.9 v56.13,56.9 | v62.99,38.35 62.99,41.15 64.77,42.93 | 64.77,42.93 65.53,43.69 65.53,50.04 IC4.12 | v78.99,32 78.99,32.77 78.49,33.27 v78.49,37.08 | v72.39,43.94 68.33,43.94 67.31,42.93 64.77,42.93
D7  (via drill 0.3)
  Top 0.305: v56.13,26.42 60.2,26.42 65.53,21.08 67.06,21.08 | 67.06,21.08 69.09,21.08 74.68,15.49 v76.45,15.49 | v67.06,43.69 67.06,42.67 65.53,41.15 65.53,35.05 67.06,33.53 v67.06,30.73 | 67.06,21.08 v67.06,21.84
  Bottom 0.305: IC5.12 52.07,30.48 v56.13,26.42 | v76.45,15.49 76.45,13.72 EXTOUT.6 | v67.06,43.69 IC4.13 | v67.06,21.84 v67.06,30.73
D8
  Bottom 0.305: IC4.14 70.61,50.04 70.61,46.74 74.17,43.18 IC6.9
D9  (via drill 0.3)
  Top 0.305: v62.23,62.48 58.42,62.48 57.4,61.47 52.83,61.47 51.05,63.25 50.55,63.25 LCD.14
  Bottom 0.305: v62.23,62.48 65.28,62.48 67.31,60.45 67.82,60.45 IC4.15
D10  (via drill 0.3)
  Top 0.305: v12.45,48.77 13.97,47.24 14.99,47.24 IC8.SEL | v64.52,61.72 v65.79,62.99
  Bottom 0.305: v12.45,48.77 12.45,60.45 18.03,66.04 62.74,66.04 v65.79,62.99 | v64.52,61.72 67.06,59.18 IC4.16
D+
  Top 0.305: RD+.1 41.91,35.05 IC7.2
D-
  Top 0.305: RD-.1 31.75,41.66 39.62,33.78 43.94,33.78 IC7.3
GND
  Top 0.813: BAT1.GND 6.6,54.86 14.99,54.86 IC8.GND 15.49,55.12 16,55.12 17.27,56.39 17.27,61.21 | 17.27,61.21 17.27,63.25 LCD.1 | 17.27,61.21 25.65,61.21 26.42,61.98 26.42,62.23 27.43,63.25 LCD.5 | D3.A 28.7,34.8 RB.2 28.45,35.05 27.18,36.32 CT.2 22.61,35.56 21.84,35.56 | 21.84,35.56 IC1.4 | D2.A 21.84,35.31 21.84,35.56 | 21.08,15.24 C2.- 16.26,22.86 16.26,23.11 | 21.08,15.24 C3.- | 21.08,15.24 T1.1 | 10.41,18.54 8.13,20.83 USB.S1 | 10.41,18.54 10.92,18.03 | 10.92,18.03 12.7,16.26 12.7,14.99 C1.- | 10.67,23.11 10.67,18.8 10.41,18.54 | 10.67,23.11 10.67,25.65 USB.GND 10.41,25.91 8.13,28.19 8.13,32.77 USB.S2 | 10.67,23.11 16.26,23.11 | 16.26,23.11 IC2.1 | J0.1 10.67,17.78 10.92,18.03 | C4.2 CR.2 | C5.2 62.74,61.47 RLED.2 69.34,60.96 IC6.2 | IC6.21 82.04,45.72 82.04,48.26 IC6.22 | EXTOUT.3 EXTOUT.5 EXTOUT.7 87.38,3.3 87.38,3.81 88.9,5.33 88.9,10.41 RJ1.SHIELD1 | RJ1.G- 98.81,16.26 98.81,24.38 RJ1.Y- | R6.2 81.28,26.67 83.06,26.67 84.84,24.89 RJ1.GND 85.09,25.15 87.38,25.15 90.42,28.19 RJ1.SHIELD0 90.93,28.45 90.93,33.78 91.95,34.8 RN1.8
  Bottom 0.813: D2.A 9.4,31.5 8.13,32.77 USB.S2 | RB.2 27.69,36.32 27.69,63.25 LCD.5 | 54.36,55.88 54.36,56.13 IC4.22 | 54.36,55.88 IC4.8 54.61,50.8 54.61,47.5 55.37,46.74 56.9,46.74 58.17,45.47 CR.2 | 90.93,58.42 91.95,58.42 C6.- | 90.93,58.42 88.9,60.45 86.87,60.45 C7.1 85.09,62.23 80.52,62.23 79.25,60.96 IC6.2 | C8.1 87.63,46.99 86.61,48.01 | 86.61,48.01 86.36,48.26 IC6.22 | CX2.2 70.87,34.8 74.17,38.1 IC6.11 | IC3.4 65.28,35.05 66.04,34.29 CX2.2 | CX1.2 73.41,37.85 IC6.11 | IC6.11 79.76,38.1 | 79.76,38.1 IC6.18 | 79.76,38.1 79.76,43.69 81.79,45.72 IC6.21 | 90.93,58.42 90.68,58.17 90.68,56.13 86.87,52.32 86.87,48.26 86.61,48.01 | 54.36,55.88 59.18,55.88 60.71,57.4 60.71,60.71 C5.2 | 91.19,23.62 90.93,23.88 90.93,28.19 RJ1.SHIELD0 | 91.19,23.62 98.55,16.26 RJ1.G- | RJ1.SHIELD1 90.93,12.45 90.93,23.37 91.19,23.62 | 39.62,17.27 39.62,16 T3.1 38.86,15.75 35.05,15.75 34.54,15.24 T2.1 34.54,15.75 29.97,15.75 29.46,15.24 T1.1 | 39.62,17.27 39.62,20.57 38.86,21.34 38.86,25.91 C9.2 39.12,25.65 43.18,29.72 43.18,32.26 43.94,33.02 45.21,33.02 47.24,35.05 IC7.4 | 39.62,17.27 39.88,17.27 41.91,15.24 T4.1 44.2,15.49 45.21,15.49 45.47,15.75 52.32,15.75 T5.1 52.32,15.24 52.83,15.75 56.13,15.75 T6.1 56.9,15.49 57.91,15.49 59.69,17.27 | 59.69,17.27 IC5.8 | 59.69,17.27 T7.1 61.98,15.49 62.99,15.49 63.25,15.75 66.8,15.75 T8.1 67.31,15.75 67.31,17.53 | JP1.7 70.87,24.13 70.61,23.88 | 70.61,23.88 67.31,20.57 67.31,17.53 | J1.1 71.12,13.97 67.56,17.53 67.31,17.53 | 72.39,23.62 70.87,23.62 70.61,23.88 | 72.39,23.62 78.23,23.62 81.28,26.67 R6.2 | 72.39,23.62 72.39,28.19 71.12,29.46 71.12,34.04 CX2.2
  pour Top (isolate 0.305, hatched): 0,73.66 99.06,73.66 99.06,0 0,0
  pour Bottom (isolate 0.305, hatched): 0,73.66 101.6,73.66 101.6,0 0,0
LEDA
  Top 0.305: R8.2 92.46,32.26 97.54,27.18 97.54,14.73 98.55,13.72 RJ1.G+
LEDB
  Bottom 0.305: R9.2 94.74,30.73 98.55,26.92 RJ1.Y+
MISO  (via drill 0.3)
  Top 0.305: v34.8,45.47 33.27,46.99 31.24,46.99 IC8.SDO | v43.94,45.47 v37.08,45.47 | IC4.18 67.82,52.83 72.14,52.83 74.17,50.8 IC6.6 | IC7.6 45.97,42.67 47.24,43.94 49.78,43.94 52.32,46.48 52.32,48.77 v52.58,49.02 | v54.61,45.47 56.13,46.99 56.64,46.99 57.66,48.01 57.66,49.53 57.91,49.78 57.91,53.34 v59.44,54.86
  Bottom 0.305: v37.08,45.47 v34.8,45.47 | v43.94,45.47 43.94,43.94 IC7.6 | v52.58,49.02 52.58,48.77 52.32,48.51 52.32,45.97 52.83,45.47 v54.61,45.47 | v59.44,54.86 61.98,57.4 IC4.18
MOSI  (via drill 0.3)
  Top 0.305: v17.02,51.05 15.24,51.05 IC8.SDI | v19.05,46.23 26.92,46.23 30.73,42.42 30.73,41.66 v32,40.39 | v37.08,40.89 45.97,40.89 IC7.5 | v60.71,40.64 56.9,36.83 56.64,36.83 55.63,35.81 55.63,33.78 54.61,32.77 v53.59,32.77
  Bottom 0.305: 64.77,58.42 66.04,57.15 66.04,56.9 74.17,48.77 74.17,48.26 IC6.7 | v17.02,51.05 17.02,48.26 v19.05,46.23 | v32,40.39 36.58,40.39 v37.08,40.89 | 64.77,58.42 59.18,52.83 56.39,52.83 55.88,52.32 55.88,49.78 57.66,48.01 57.66,47.5 58.67,46.48 59.18,46.48 60.71,44.96 v60.71,40.64 | v53.59,32.77 53.09,33.27 49.53,33.27 49.02,33.78 49.02,41.4 IC7.5 | 64.77,58.42 IC4.17
N$1
  Top 1.27: 88.14,71.88 12.7,71.88 arc90 11.68,70.87 11.68,62.23 14.99,59.18
N$2
  Bottom 0.305: IC4.9 58.93,49.02 62.48,49.02 X1.2
N$3
  Top 0.305: RN2.2 30.73,13.97 T1.2
N$4
  Top 0.305: RN3.3 52.07,23.11 IC5.5
N$5
  Top 0.305: IC5.6 56.9,21.08 59.18,21.08 RN3.5
N$6  (via drill 0.3)
  Top 0.813: J2.2 2.03,38.35 4.32,36.07 v4.32,18.8
  Bottom 0.813: v4.32,18.8 4.32,14.99 2.29,12.95 J0.2
N$7
  Top 0.305: IC5.7 58.93,21.59 63.75,21.59 RN3.7
N$8
  Top 0.305: IC4.10 62.48,48.01 68.58,48.01 X1.1
N$9  (via drill 0.3)
  Top 0.813: RSC1.2 RSC.2 | v25.65,21.08 D1.C 22.1,31.75 v22.1,34.04
  Bottom 0.813: 16.51,41.91 10.67,36.07 RSC1.2 | 16.51,41.91 IC1.6 | C1.+ 22.1,14.99 25.65,18.54 v25.65,21.08 | 16.51,41.91 22.1,36.32 v22.1,34.04
N$10
  Top 0.305: RN3.1 50.8,22.1 IC5.4
N$11
  Top 0.305: RN2.7 43.43,19.81 IC5.3
N$12
  Top 0.305: RN2.5 40.64,21.59 42.67,21.59 IC5.2
N$13
  Top 0.305: RN2.3 35.81,21.84 40.13,21.84 41.66,23.37 IC5.1
N$14  (via drill 0.3)
  Top 0.305: RN2.1 31.24,22.35 37.34,22.35 v40.13,25.15
  Bottom 0.305: v40.13,25.15 41.66,26.67 41.66,26.92 44.45,29.72 IC5.15
N$15
  Top 0.305: RN2.4 35.81,13.97 T2.2
N$16
  Top 0.813: T1.3 28.7,5.59 S12.1
N$17
  Top 0.813: T2.3 33.78,5.33 36.58,2.54 S12.2
N$18
  Top 0.813: T3.3 38.86,5.59 S34.1
N$19
  Top 0.305: RN2.6 40.89,13.97 T3.2
N$20
  Top 0.813: T4.3 43.94,5.33 46.74,2.54 S34.2
N$21
  Top 0.305: RN2.8 45.97,13.97 T4.2
N$22
  Bottom 0.813: T5.3 51.56,3.05 S56.1
N$23
  Bottom 0.813: T6.3 56.64,2.79 56.9,2.54 S56.2
N$24
  Bottom 0.813: T7.3 61.72,3.05 S78.1
N$25
  Bottom 0.813: T8.3 66.8,2.79 67.06,2.54 S78.2
N$26
  Top 0.305: RN3.2 53.34,13.97 T5.2
N$27
  Top 0.305: RN3.4 58.42,13.97 T6.2
N$28
  Top 0.305: RN3.6 63.5,13.97 T7.2
N$29
  Top 0.305: RN3.8 68.58,13.97 T8.2
N$32
  Top 0.305: RN1.3 RN1.2 93.98,53.34 93.98,54.36 95,55.37 97.79,55.37 B1.1
N$33
  Bottom 0.305: RN1.6 98.3,34.8 B3.1
N$35
  Top 0.305: RN1.4 91.95,45.21 | 91.95,45.21 RN1.5 | 91.95,45.21 97.79,45.21 B2.1
N$36  (via drill 0.3)
  Top 0.305: v42.42,26.67 40.64,26.67 v39.62,27.69 | v26.92,21.08 26.16,20.32 25.15,20.32 23.62,21.84 23.62,24.38 17.78,30.23 15.75,30.23 10.41,35.56 10.41,38.35 5.59,43.18 5.59,47.24 BAT1.VCC@1
  Bottom 0.305: IC3.3 59.69,33.27 60.71,32.26 60.71,28.45 62.74,26.42 63.75,26.42 64.52,25.65 64.52,24.64 63.75,23.88 61.47,23.88 59.69,25.65 43.43,25.65 v42.42,26.67 | v39.62,27.69 39.12,27.18 37.85,27.18 31.75,21.08 v26.92,21.08
N$37  (via drill 0.3)
  Top 0.305: R8.1 85.85,33.27 89.15,36.58 89.15,53.85 v87.88,55.12
  Bottom 0.305: v87.88,55.12 82.04,60.96 IC6.27
N$38  (via drill 0.3)
  Top 0.305: RD+.2 34.29,34.54 v26.67,26.92
  Bottom 0.305: v26.67,26.92 23.37,26.92 22.86,26.42 13.97,26.42 13.46,26.92 11.94,26.92 10.92,27.94 USB.D+
N$39  (via drill 0.3)
  Top 0.305: v79.25,33.53 79.25,55.88 81.79,58.42 IC6.26
  Bottom 0.305: R9.1 83.82,30.73 82.55,32 80.77,32 v79.25,33.53
N$40
  Top 0.813: RSC.1 RSC1.1 9.65,43.43 12.45,43.43 IC1.8 | IC1.8 IC1.1 | IC1.8 IC1.7
N$45  (via drill 0.3)
  Top 0.305: R7.1 35.81,36.07 33.78,36.07 32.77,35.05 RD-.2 31.75,32.77 28.96,29.97 v25.65,29.97
  Bottom 0.305: v25.65,29.97 22.61,26.92 17.53,26.92 16.51,27.94 12.95,27.94 USB.D-
N$46
  Bottom 0.813: IC1.2 17.78,33.02 24.13,33.02 D2.C 28.45,28.7 31.75,28.7 L1.1
N$47
  Bottom 0.305: X3.2 53.09,34.29 54.1,33.27 55.37,33.27 IC3.2
N$48
  Top 0.305: RLED.1 56.64,64.52 55.63,63.5 LCD.16
  Bottom 0.305: LCD.3 22.61,63.5 23.11,63.5 24.64,65.02 53.85,65.02 55.37,63.5 LCD.16
N$49  (via drill 0.3)
  Top 0.305: IC1.3 17.78,40.89 16.76,41.91 v16.76,44.7
  Bottom 0.305: v16.76,44.7 17.02,44.7 17.27,44.96 18.29,44.96 19.3,43.94 19.3,41.91 22.35,38.86 CT.1
N$50
  Top 0.305: C6.+ 91.95,60.2 91.19,60.2 86.87,64.52 75.44,64.52 74.42,63.5 IC6.1
N$51
  Bottom 0.305: R6.1 73.66,26.67 74.68,26.67 76.96,24.38 77.47,24.38 77.98,24.89 77.98,26.92 74.42,30.48 IC6.14
N$52  (via drill 0.3)
  Top 0.305: X2.1 68.58,40.64 CX1.1 71.63,43.69 v71.63,46.74
  Bottom 0.305: v71.63,46.74 75.18,46.74 81.79,53.34 IC6.24
N$53
  Top 0.305: X2.2 69.6,35.56 CX2.1
  Bottom 0.305: IC6.23 81.79,50.8 80.77,49.78 80.52,49.78 76.2,45.47 76.2,42.93 74.93,41.66 70.61,41.66 66.8,37.85 66.8,35.56 X2.2
N$54
  Top 0.305: R2.2 R3.1 C7.2
N$55
  Top 0.305: IC1.5 25.91,43.18 RT.2 RB.1
N$57
  Top 0.305: X3.1 51.05,34.29 52.07,33.27 53.09,33.27 54.61,34.8 IC3.1
QH*  (via drill 0.3)
  Top 0.305: IC5.9 65.79,30.99 66.8,29.97 v72.39,29.97 | v77.22,25.15 77.22,7.87 EXTOUT.2
  Bottom 0.305: v77.22,25.15 v72.39,29.97
RD+  (via drill 0.3)
  Top 0.305: v79.5,27.94 79.5,20.83 84.33,16 85.34,16 87.38,18.03 RJ1.RD+ | v77.47,43.43 77.47,36.07 74.42,33.02 IC6.13
  Bottom 0.305: v79.5,27.94 74.42,33.02 IC6.13 | R3.2 88.14,48.51 89.15,47.5 89.15,46.48 88.65,45.97 83.82,45.97 83.06,46.74 80.77,46.74 v77.47,43.43
RD-  (via drill 0.3)
  Top 0.305: v76.71,39.12 76.71,37.85 74.42,35.56 IC6.12
  Bottom 0.305: IC6.12 74.42,35.56 83.57,26.42 83.57,23.62 84.84,22.35 RJ1.RD- | R2.1 84.84,51.56 82.55,49.28 80.77,49.28 76.71,45.21 v76.71,39.12
RESET  (via drill 0.3)
  Top 0.305: v70.1,30.73 71.88,32.51 71.88,37.85 74.17,40.13 74.17,40.64 IC6.10 | IC7.1 40.13,35.81 v34.54,41.4 | JP1.6 67.56,27.69 66.29,28.96 60.71,28.96 60.45,28.7 41.66,28.7 v41.15,29.21
  Bottom 0.305: v70.1,30.73 70.1,29.46 JP1.6 | IC4.1 36.58,48.77 RN4.2 38.1,45.47 35.81,43.18 35.81,42.67 v34.54,41.4 | v41.15,29.21 40.13,30.23 IC7.1
SCK  (via drill 0.3)
  Top 0.305: v13.21,49.28 14.99,49.28 IC8.SCK | IC6.8 73.66,45.72 70.1,49.28 66.55,49.28 65.53,50.29 65.53,52.58 IC4.19 | IC7.7 41.91,42.67 40.64,41.4 37.59,41.4 37.34,41.66 36.32,41.66 35.31,42.67 35.31,43.18 32.51,45.97 29.72,45.97 v18.29,57.4
  Bottom 0.305: v13.21,49.28 13.21,56.9 16,59.69 | 16,59.69 19.05,62.74 19.05,64.52 20.07,65.53 55.63,65.53 58.67,62.48 59.44,62.48 59.94,61.98 59.94,59.18 IC4.19 | 16,59.69 v18.29,57.4
SCL  (via drill 0.3)
  Top 0.305: IC4.28 42.42,52.83 47.24,52.83 48.26,51.82 RN4.6 | v65.79,32.51 65.79,33.27 63.75,35.31 63.75,38.61 IC3.6
  Bottom 0.305: RN4.6 51.56,43.94 53.59,43.94 54.1,44.45 57.91,44.45 IC3.6 | v65.79,32.51 JP1.4
SDA  (via drill 0.3)
  Top 0.305: IC4.27 41.91,55.88 46.74,55.88 50.8,51.82 50.8,49.78 v51.56,49.02 | v52.32,44.7 52.32,43.69 53.59,42.42 53.59,41.4 54.1,40.89 57.66,40.89 58.67,41.91 58.67,43.94 59.18,44.45 60.45,44.45 IC3.5
  Bottom 0.305: RN4.3 40.64,57.15 IC4.27 | IC3.5 62.23,37.34 61.21,36.32 61.21,29.72 JP1.2 | v51.56,49.02 51.56,48.77 51.82,48.51 51.82,45.21 v52.32,44.7
TCT
  Top 0.305: C8.2 R4.2 R5.1
  Bottom 0.305: 83.57,20.83 L2.1 | 83.57,20.83 84.84,19.56 RJ1.P4 | R5.1 88.14,38.61 89.15,37.59 89.15,15.49 88.39,14.73 85.6,14.73 83.57,16.76 83.57,20.83
TD+
  Top 0.305: IC6.17 86.61,35.56 R5.2
  Bottom 0.305: RJ1.TD+ 87.38,16.76 88.65,18.03 88.65,36.58 R5.2
TD-
  Top 0.305: RJ1.TD- 84.84,18.03 82.55,20.32 82.55,23.88 80.26,26.16 80.26,27.43 82.3,29.46 83.06,29.46 83.82,30.23 83.82,31.24 82.04,33.02 IC6.16
  Bottom 0.305: R4.1 82.04,33.53 82.04,33.02 IC6.16
VCC
  Top 0.305: IC8.VDD 14.99,57.15 4.32,57.15 3.81,56.64 3.81,46.74 5.08,45.47 5.08,36.07 6.1,35.05 9.4,35.05 20.07,24.38 20.83,24.38 22.1,23.11 IC2.3 | C4.1 54.86,48.01 IC4.7 56.9,56.13 IC4.20 | RN4.1 35.56,43.94 R7.2 IC7.8 41.91,44.45 48.01,44.45 RN4.7 | C9.1 38.86,28.7 39.37,28.7 41.66,30.99 IC5.16 43.69,29.21 55.37,29.21 IC5.10 58.93,29.21 60.2,29.21 60.45,29.46 69.09,29.46 JP1.8 71.88,26.67 | L2.2 71.12,23.62 72.14,24.64 72.14,26.42 71.88,26.67 | 80.01,32.77 81.79,30.99 81.79,30.48 IC6.15 | 80.01,32.77 80.01,38.86 81.79,40.64 IC6.19 82.04,40.64 82.04,43.18 | RN1.1 90.17,53.85 88.14,55.88 83.82,55.88 | IC6.25 83.82,55.88 | 83.82,55.88 83.82,61.21 82.04,62.99 82.04,63.5 IC6.28 | 82.04,43.18 82.04,43.69 83.82,45.47 83.82,55.88 | 82.04,43.18 IC6.20 | 71.88,26.67 74.68,29.46 75.44,29.46 78.74,32.77 80.01,32.77
  Bottom 0.305: C3.+ 22.61,12.45 21.34,13.72 16,13.72 14.99,14.73 14.99,16 22.1,23.11 IC2.3 24.89,23.11 29.21,27.43 37.34,27.43 38.61,28.7 C9.1 | RN4.7 50.8,50.04 IC4.7 | IC7.8 40.13,36.83 41.4,35.56 41.4,31.5 IC5.16 | EXTOUT.1 79.5,3.81 75.69,7.62 75.69,16.26 L2.2
VIN
  Top 0.813: IC3.8 54.61,43.94 CR.1 | D3.C 36.32,28.19 32,23.88 L1.2 | C2.+ 23.11,20.07 IC2.2 17.53,25.65 12.95,25.65 USB.VBUS
  Bottom 0.813: RN4.5 48.01,49.53 48.01,52.32 50.55,54.86 50.55,59.94 52.83,62.23 52.83,63.25 LCD.15 | RN4.5 RN4.4 40.13,44.2 39.62,44.2 38.1,42.67 38.1,34.29 D3.C 35.05,33.78 28.19,33.78 27.18,34.8 26.67,34.8 RT.1 26.42,39.62 20.07,45.97 20.07,63.25 LCD.2 | JP1.1 62.74,25.15 58.42,29.46 58.42,38.86 IC3.8 54.1,43.18 49.78,43.18 RN4.5 | C2.+ 23.11,20.07 26.67,23.62 31.75,23.62 L1.2

### Text on the board
tNames: OpenSprinkler (v1.42u) | Rayshobby, Mar 2013 | MEGA328 | RFM12B | D2 | D10 | 34063 | TINY45 | DS1307 | ENC28J60 | 1N5819 | Zener | R3000 | SDA SCL RST VCC | USB | 74HC595 | VIN A2 A3 GND | RJ45 | 100u | AC IN | Rain Sense | 1 | 2 | 3 | 4 | 5 | 6 | 7 | 8 | EXTOUT
BoxDim: Serpac WM-032RC Enclosure | All units are in inch | Left | Right | Front | 0.14 | 0.32 | 1.28 | 0.91 | 0.32 | 1.0 | 0.26 | 0.4 | 0.29 | 3.25 | 0.45 | 0.7 | 0.53 | 0.4 | 0.32 | 0.63 | Bottom | 1.28 | 0.32 | 1.6 | 1.6 | 4.38